# EAGLE design MainBoard (EAGLE 9.5.1)
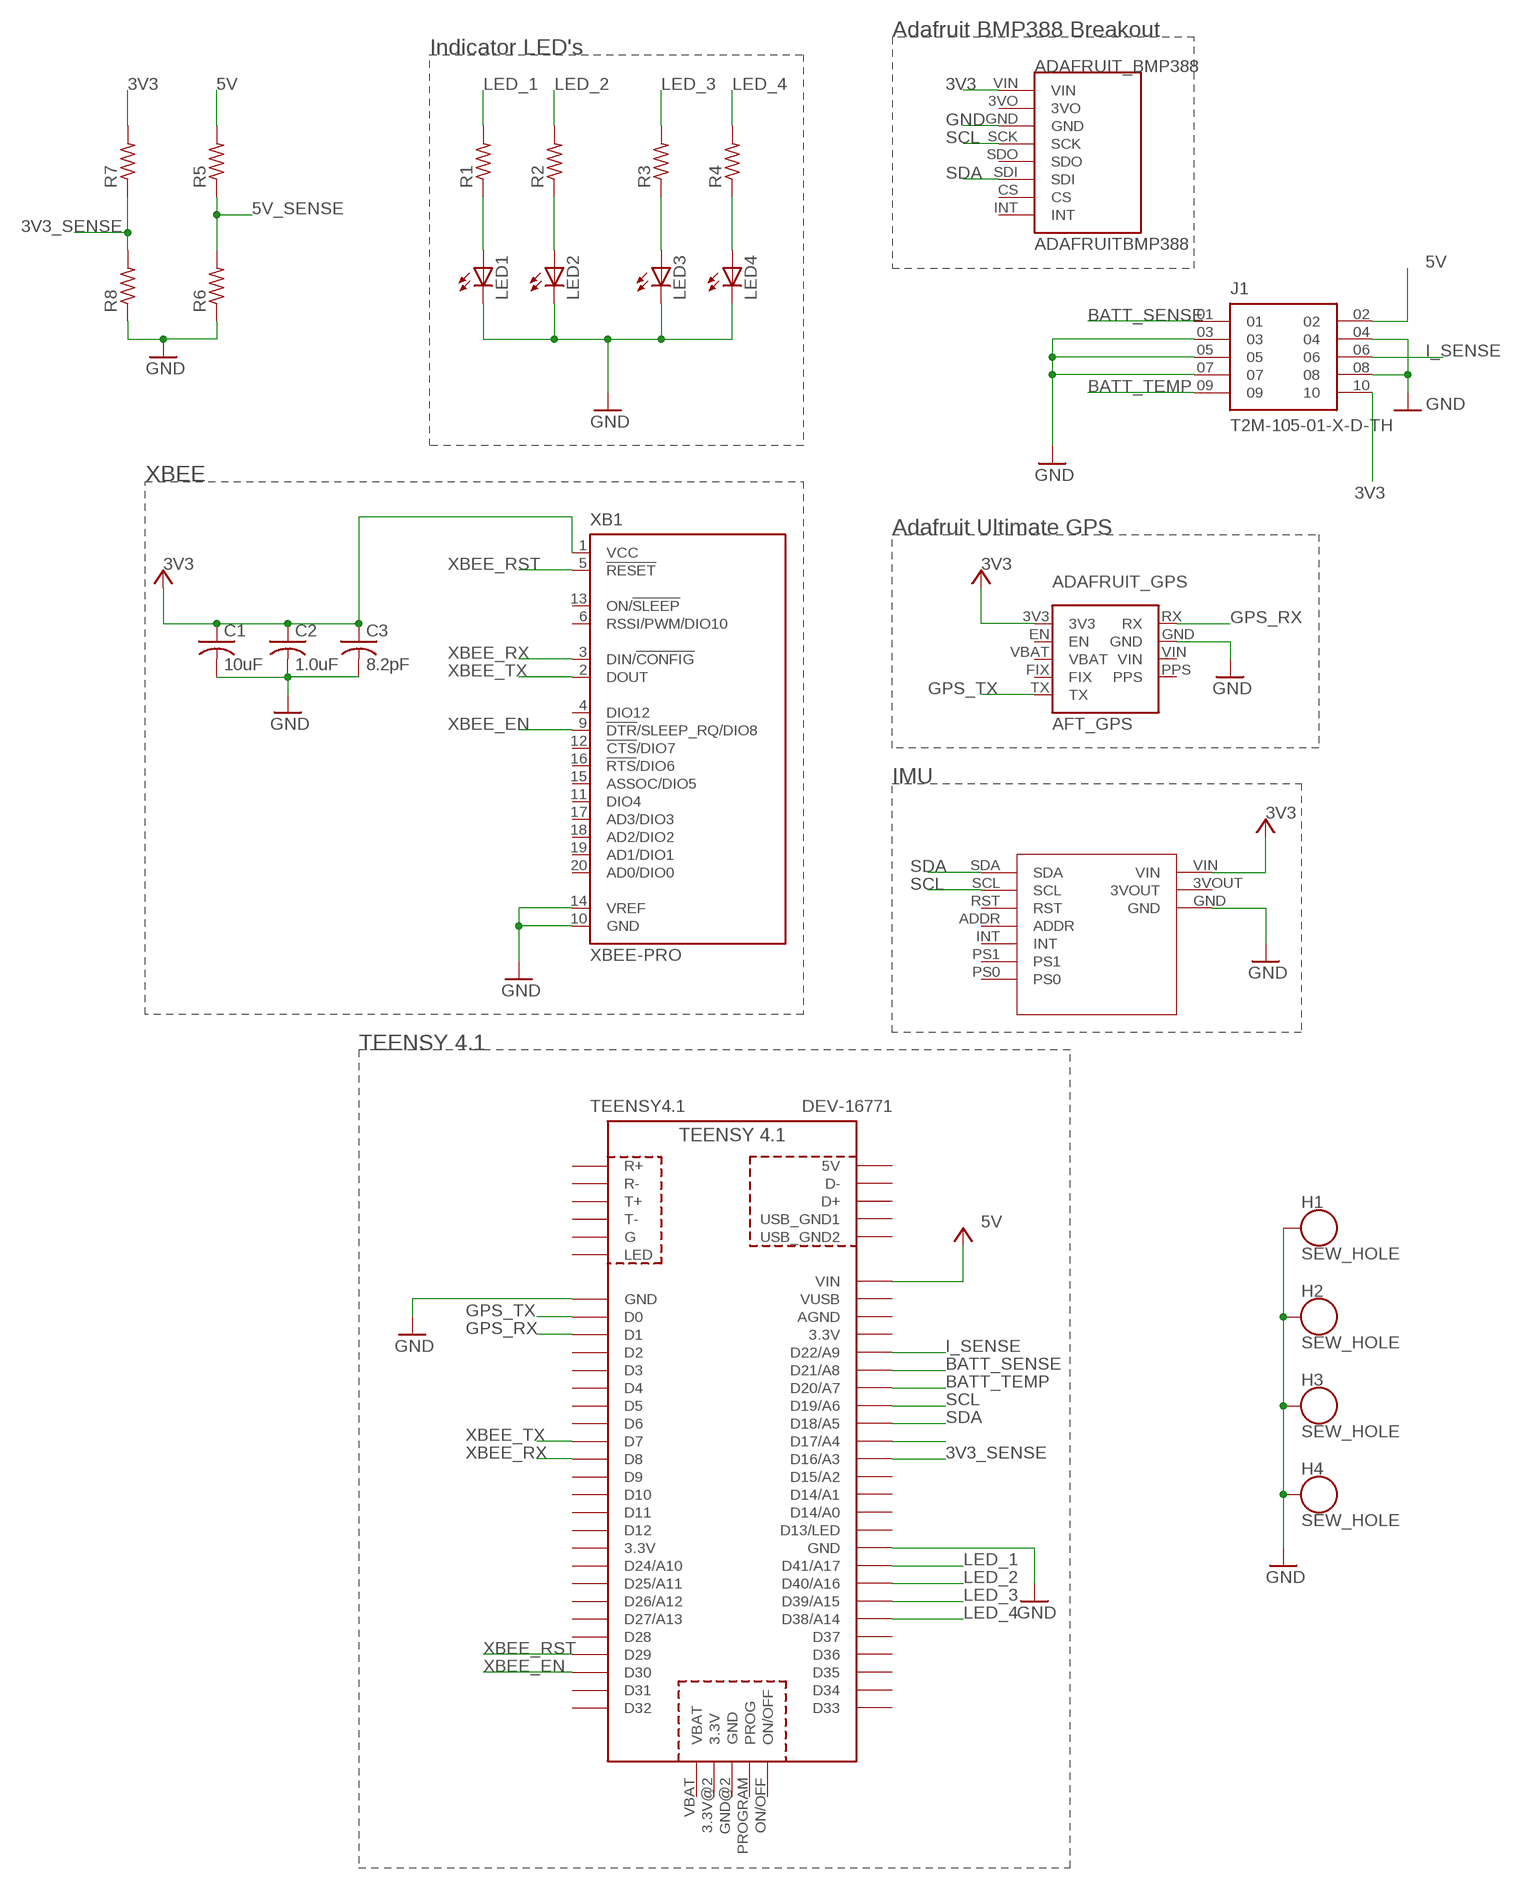
[diagram p0: schematic, sheet 1]

## Parts
ADAFRUIT_BMP388  ADAFRUITBMP388  [ADAFRUITBMP388]
ADAFRUIT_GPS  AFT_GPS  [AFT_GPS]
C1  10uF  C-USC0805  [C0805]
C2  1.0uF  C-USC0805  [C0805]
C3  8.2pF  C-USC0805  [C0805]
H1  SEW_HOLE  [SIMPLE_HOLE]
H2  SEW_HOLE  [SIMPLE_HOLE]
H3  SEW_HOLE  [SIMPLE_HOLE]
H4  SEW_HOLE  [SIMPLE_HOLE]
J1  T2M-105-01-X-D-TH  [SAMTEC_T2M-105-01-X-D-TH]
LED1  LED5MM  [LED5MM]
LED2  LED5MM  [LED5MM]
LED3  LED5MM  [LED5MM]
LED4  LED5MM  [LED5MM]
R1  R-US_R0805  [R0805]
R2  R-US_R0805  [R0805]
R3  R-US_R0805  [R0805]
R4  R-US_R0805  [R0805]
R5  R-US_R0805  [R0805]
R6  R-US_R0805  [R0805]
R7  R-US_R0805  [R0805]
R8  R-US_R0805  [R0805]
TEENSY4.1  DEV-16771  [DEV-16771]
U$1  IMU_BREAKOUT  [BNO055_BREAKOUT]
XB1  XBEE-PRO  [XBEE-PRO]

## Nets
3V3: ADAFRUIT_BMP388.VIN ADAFRUIT_GPS.3V3 C1.1 C2.1 C3.1 J1.10 R7.2 U$1.VIN XB1.1(VCC) ; supply symbol labelled VCC
3V3_SENSE: R7.1 R8.2 TEENSY4.1.D17/A3(D16/A3)
5V: J1.02 R5.2 TEENSY4.1.VIN ; supply symbol labelled VCC
5V_SENSE: R5.1 R6.2 TEENSY4.1.D18/A4(D17/A4)
BATT_SENSE: J1.01 TEENSY4.1.D22/A8(D21/A8)
BATT_TEMP: J1.09 TEENSY4.1.D21/A7(D20/A7)
GND: ADAFRUIT_BMP388.GND ADAFRUIT_GPS.GND C1.2 C2.2 C3.2 H1.P$1 H2.P$1 H3.P$1 H4.P$1 J1.03 J1.04 J1.05 J1.07 J1.08 LED1.K(C) LED2.K(C) LED3.K(C) LED4.K(C) R6.1 R8.1 TEENSY4.1.GND TEENSY4.1.GND@1(GND) U$1.GND XB1.10(GND) XB1.14(VREF)
GPS_RX: ADAFRUIT_GPS.RX TEENSY4.1.D1
GPS_TX: ADAFRUIT_GPS.TX TEENSY4.1.D0
I_SENSE: J1.06 TEENSY4.1.D23/A9(D22/A9)
LED_1: R1.2 TEENSY4.1.D41/A17
LED_2: R2.2 TEENSY4.1.D40/A16
LED_3: R3.2 TEENSY4.1.D39/A15
LED_4: R4.2 TEENSY4.1.D38/A14
N$8: LED1.A R1.1
N$9: LED2.A R2.1
N$10: LED3.A R3.1
N$11: LED4.A R4.1
SCL: ADAFRUIT_BMP388.SCK TEENSY4.1.D20/A6(D19/A6) U$1.SCL
SDA: ADAFRUIT_BMP388.SDI TEENSY4.1.D19/A5(D18/A5) U$1.SDA
XBEE_EN: TEENSY4.1.D30 XB1.9(!DTR!/SLEEP_RQ/DIO8)
XBEE_RST: TEENSY4.1.D29 XB1.5(!RESET)
XBEE_RX: TEENSY4.1.D8 XB1.3(DIN/!CONFIG)
XBEE_TX: TEENSY4.1.D7 XB1.2(DOUT)
Unconnected: ADAFRUIT_BMP388.3VO ADAFRUIT_BMP388.CS ADAFRUIT_BMP388.INT ADAFRUIT_BMP388.SDO ADAFRUIT_GPS.EN ADAFRUIT_GPS.FIX ADAFRUIT_GPS.PPS ADAFRUIT_GPS.VBAT ADAFRUIT_GPS.VIN TEENSY4.1.D2 TEENSY4.1.D3 TEENSY4.1.D4 TEENSY4.1.D5 TEENSY4.1.D6 TEENSY4.1.D9 TEENSY4.1.D10 TEENSY4.1.D11 TEENSY4.1.D12 TEENSY4.1.D13/LED TEENSY4.1.D14/A0 TEENSY4.1.D15/A1(D14/A1) TEENSY4.1.D16/A2(D15/A2) TEENSY4.1.D24/A10 TEENSY4.1.D25/A11 TEENSY4.1.D26/A12 TEENSY4.1.D27/A13 TEENSY4.1.D28 TEENSY4.1.D31 TEENSY4.1.D32 TEENSY4.1.D33 TEENSY4.1.D34 TEENSY4.1.D35 TEENSY4.1.D36 TEENSY4.1.D37 TEENSY4.1.D+ TEENSY4.1.D- TEENSY4.1.LED TEENSY4.1.ON/OFF TEENSY4.1.PROGRAM(PROG) TEENSY4.1.R+ TEENSY4.1.R- TEENSY4.1.T+ TEENSY4.1.T- U$1.3VOUT U$1.ADDR U$1.INT U$1.PS0 U$1.PS1 U$1.RST XB1.4(DIO12) XB1.6(RSSI/PWM/DIO10) XB1.11(DIO4) XB1.12(!CTS!/DIO7) XB1.13(ON/!SLEEP) XB1.15(ASSOC/DIO5) XB1.16(!RTS!/DIO6) XB1.17(AD3/DIO3) XB1.18(AD2/DIO2) XB1.19(AD1/DIO1) XB1.20(AD0/DIO0)

## Notes on the sheet
- Adafruit BMP388 Breakout
- Indicator LED's
- XBEE
- Adafruit Ultimate GPS
- IMU
- TEENSY 4.1

## Power pins joined to a net without a drawn wire
3.3V: TEENSY4.1.3.3V TEENSY4.1.3.3V@1(3.3V) TEENSY4.1.3.3V@2(3.3V)
5V: TEENSY4.1.5V
AGND: TEENSY4.1.AGND
G: TEENSY4.1.G
GND: TEENSY4.1.GND@2(GND)
USB_GND1: TEENSY4.1.USB_GND(USB_GND1)
USB_GND2: TEENSY4.1.USB_GND@2(USB_GND2)
VBAT: TEENSY4.1.VBAT
VUSB: TEENSY4.1.VUSB

## Library data of the parts
ADAFRUIT_BMP388 = adafruit BMP388:ADAFRUITBMP388
ADAFRUIT_GPS = adafruit_Ultimate_GPS_Breakout:AFT_GPS
C1-C3 = adafruit(seeIMUBreakout):C-US: CAPACITOR, American symbol
H1-H4 = SparkFun-Retired:SEW_HOLE: SparkFun LilyPad Sew Hole Simple sew-tap with .1" diameter hole with 20mil annular ring SparkFun Products: [PRODUCT 1] <[PRODUCT1LINK]> [PRODUCT 2] <PRODUCT2LINK> [PRODUCT 3] <PRODUCT3LINK>
J1 = T2M-105-01-X-D-TH:T2M-105-01-X-D-TH; MANUFACTURER: Samtec; MAXIMUM_PACKAGE_HEIGHT: 6.55mm; PARTREV: AH; STANDARD: Manufacturer Recommendations
LED1-LED4 = adafruit(seeIMUBreakout):LED: LED OSRAM: - CHIPLED LG R971, LG N971, LY N971, LG Q971, LY Q971, LO R971, LY R971 LH N974, LH R974 LS Q976, LO Q976, LY Q976 LO Q996 - Hyper CHIPLED LW Q18S LB Q993, LB Q99A, LB R99A - SideLED LS A670, LO A670, LY A670, LG A670, LP A670 LB A673, LV A673, LT A673, LW A673 LH A674 LY A675 LS A676, LA A676, LO A676, LY A676, LW A676 LS A679, LY A679, LG A679 - Hyper Micro SIDELED® LS Y876, LA Y876, LO Y876, LY Y876 LT Y87S - SmartLED LW L88C, LW L88S LB L89C, LB L89S, LG L890 LS L89K, LO L89K, LY L89K LS L896, LA L896, LO L896, LY L896 - TOPLED LS T670, LO T670, LY T670, LG T670, LP T670 LSG T670, LSP T670, LSY T670, LOP T670, LYG T670 LG T671, LOG T671, LSG T671 LB T673, LV T673, LT T673, LW T673 LH T674 LS T676, LA T676, LO T676, LY T676, LB T676, LH T676, LSB T676, LW T676 LB T67C, LV T67C, LT T67C, LS T67K, LO T67K, LY T67K, LW E67C LS E67B, LA E67B, LO E67B, LY E67B, LB E67C, LV E67C, LT E67C LW T67C LS T679, LY T679, LG T679 LS T770, LO T770, LY T770, LG T770, LP T770 LB T773, LV T773, LT T773, LW T773 LH T774 LS E675, LA E675, LY E675, LS T675 LS T776, LA T776, LO T776, LY T776, LB T776 LHGB T686 LT T68C, LB T68C - Hyper Mini TOPLED® LB M676 - Mini TOPLED Santana® LG M470 LS M47K, LO M47K, LY M47K Source: http://www.osram.convergy.de/
R1-R8 = adafruit(seeIMUBreakout):R-US_: RESISTOR, American symbol
TEENSY4.1 = DEV-16771(Teensy 4.1):DEV-16771: Teensy 4.1 i.MX ARM® Cortex®-M7 MPU Embedded Evaluation Board Check prices <https://pricing.snapeda.com/parts/DEV-16771/SparkFun%20Electronics/view-part?ref=eda>; AVAILABILITY: Warning; DESCRIPTION: RT1062 Teensy 4.1 i.MX ARM® Cortex®-M7 MPU Embedded Evaluation Board; MF: SparkFun Electronics; MP: DEV-16771; PACKAGE: None; PRICE: None; PURCHASE-URL: https://pricing.snapeda.com/search/part/DEV-16771/?ref=eda
U$1 = adafruit(seeIMUBreakout):IMU_BREAKOUT
XB1 = xbee:XBEE: XBee (TM) /XBee-PRO(TM) OEM RF Modules Source: MaxStream, Inc. xbee_productmanual.pdf; MPN: XBP24-AWI-001; OC_FARNELL: 1337916; OC_NEWARK: 42M2667

## Board
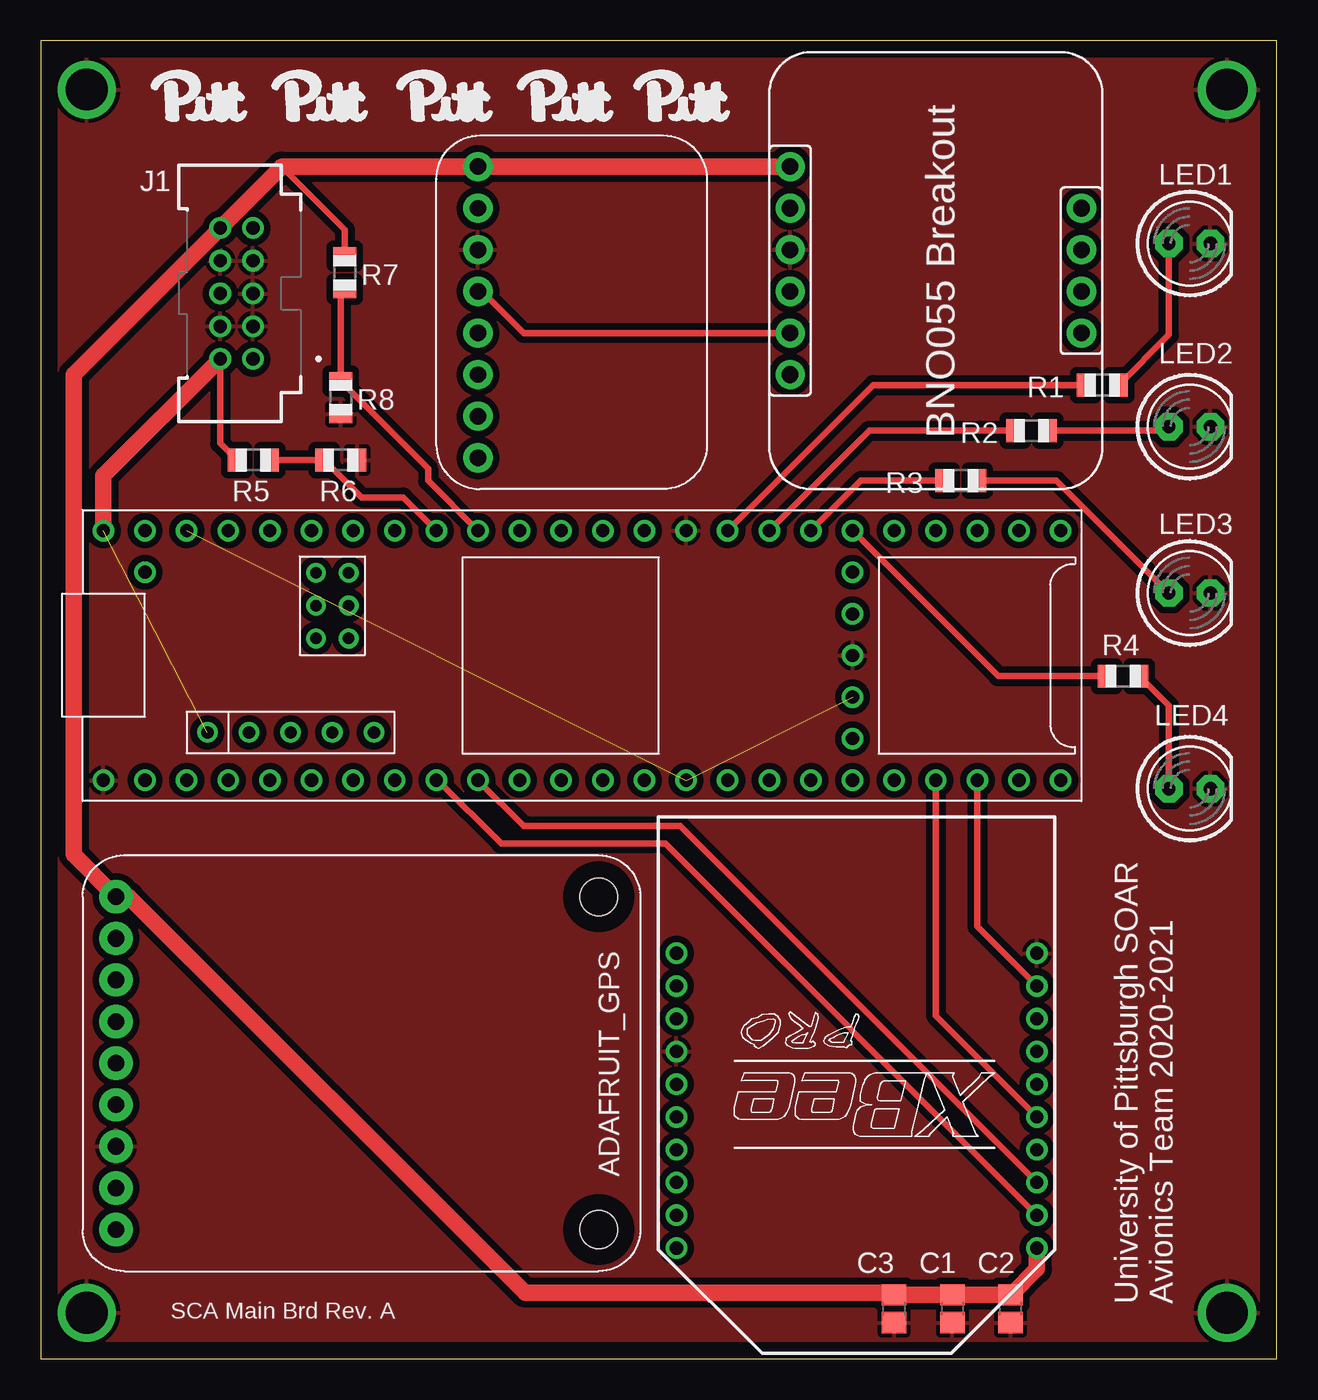
[diagram p1: board, top side]
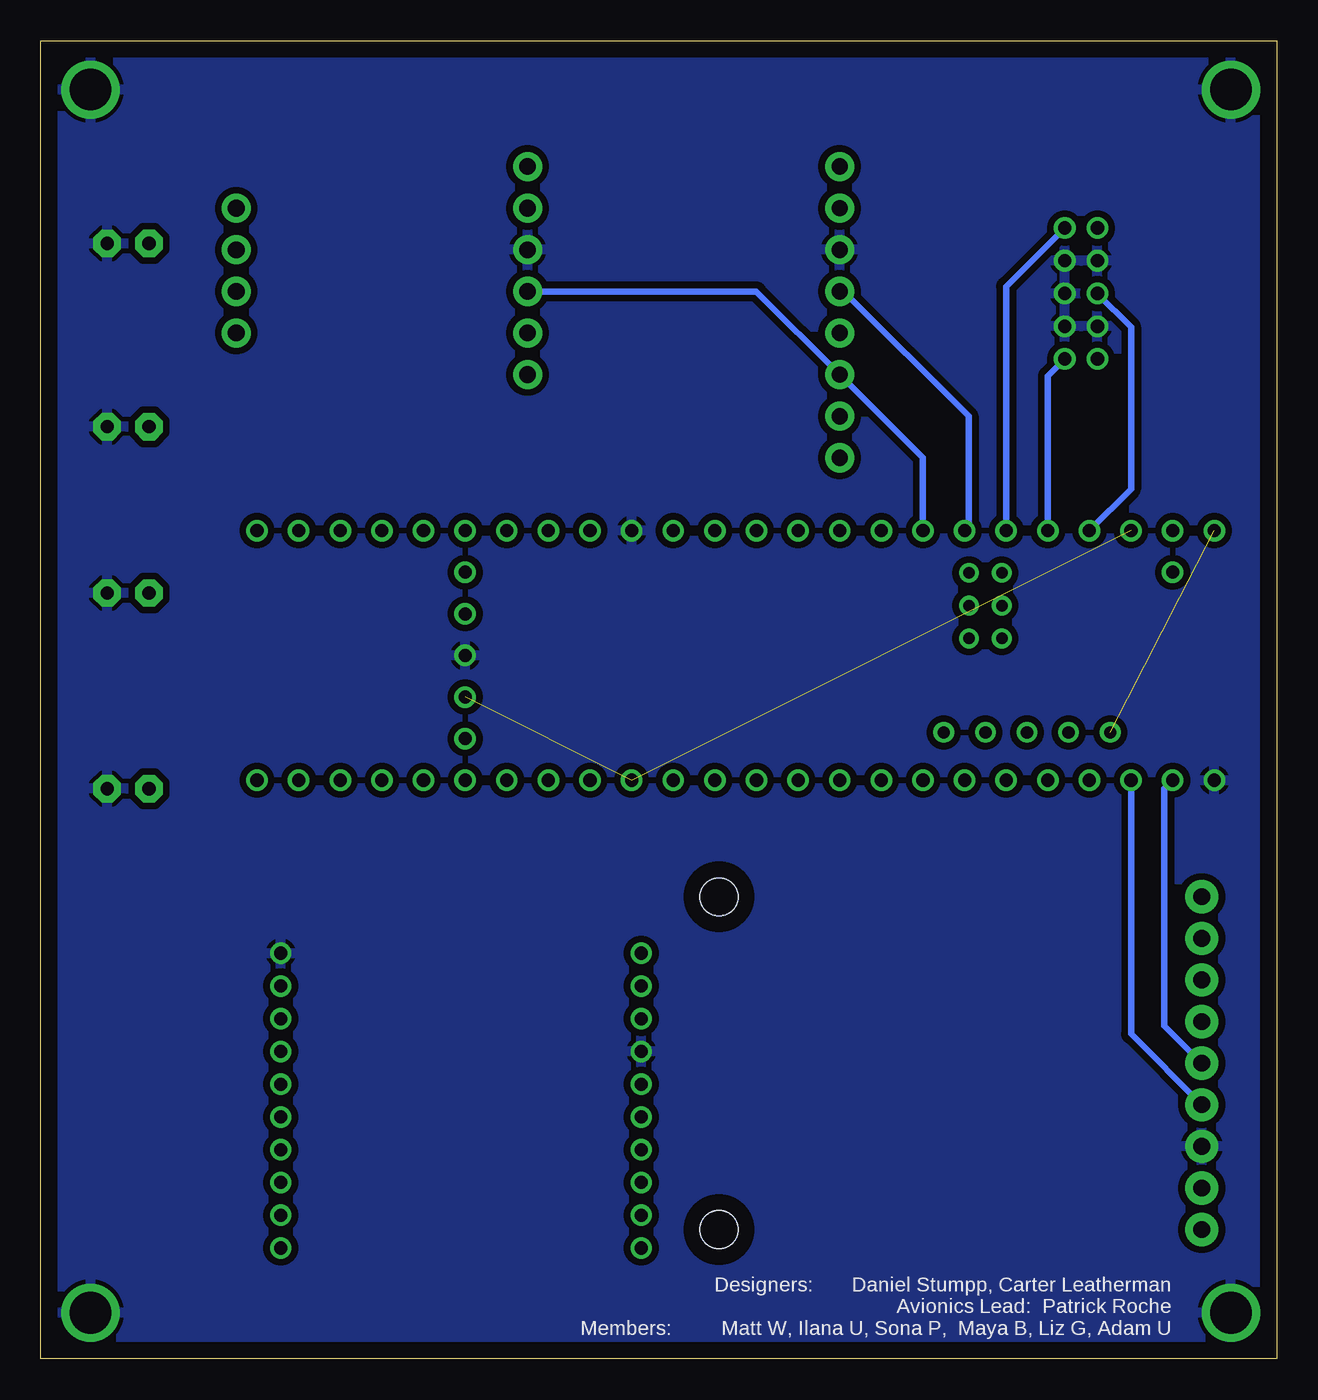
[diagram p2: board, bottom side, seen from below]

Size 75.42 x 80.44 mm. Coordinates in mm from the lower left corner, seen from the top.
Outline: 0,0 75.42,0 75.42,80.44 0,80.44 0,0
Copper layers (1*16): Top 0.035mm / dielectric 1.5mm / Bottom 0.035mm
Design rules "default": minimum track width 6mil, minimum drill 0.35mm, track to track 6mil, track to pad 6mil, pad to pad 6mil, via to via 6mil, smd to smd 6mil, copper to edge 40mil, drill to drill 6mil, minimum pad ring 10mil, minimum via ring 8mil, stop-mask expansion 4mil, vias tented up to drill 0mil, thermal gap 10mil

### Footprints (pad centres in the part's own frame; a part is rotated, then mirrored left to right if it is on the bottom)
ADAFRUITBMP388 = drill 1 pad 1.778: 3VO 4.445,2.54; CS 17.145,2.54; GND 6.985,2.54; INT 19.685,2.54; SCK 9.525,2.54; SDI 14.605,2.54; SDO 12.065,2.54; VIN 1.905,2.54
AFT_GPS = drill 1.016 pad 2.032: 3V3 2.54,2.032; EN 5.08,2.032; FIX 10.16,2.032; GND 17.78,2.032; PPS 22.86,2.032; RX 15.24,2.032; TX 12.7,2.032; VBAT 7.62,2.032; VIN 20.32,2.032 | hole 2.286: 2.54,31.496; 22.86,31.496
C0805 = smd 1.3 x 1.5: 1 -0.85,0; 2 0.85,0
SIMPLE_HOLE = drill 2.54 pad 3.048: P$1 0,0
SAMTEC_T2M-105-01-X-D-TH = drill 0.813 pad 1.163: 01 -4,-1; 02 -4,1; 03 -2,-1; 04 -2,1; 05 0,-1; 06 0,1; 07 2,-1; 08 2,1; 09 4,-1; 10 4,1
LED5MM = drill 0.813 pad 1.676 octagon: A -1.27,0; K 1.27,0
R0805 = smd 1.1 x 1.4: 1 -1,0; 2 1,0
DEV-16771 = drill 0.8: 3.3V 6.35,-7.62; 3.3V@1 -24.13,7.62; 3.3V@2 16.51,-2.54; AGND -26.67,7.62; D0 -26.67,-7.62; D1 -24.13,-7.62; D2 -21.59,-7.62; D3 -19.05,-7.62; D4 -16.51,-7.62; D5 -13.97,-7.62; D6 -11.43,-7.62; D7 -8.89,-7.62; D8 -6.35,-7.62; D9 -3.81,-7.62; D10 -1.27,-7.62; D11 1.27,-7.62; D12 3.81,-7.62; D13/LED 3.81,7.62; D14/A0 1.27,7.62; D15/A1 -1.27,7.62; D16/A2 -3.81,7.62; D17/A3 -6.35,7.62; D18/A4 -8.89,7.62; D19/A5 -11.43,7.62; D20/A6 -13.97,7.62; D21/A7 -16.51,7.62; D22/A8 -19.05,7.62; D23/A9 -21.59,7.62; D24/A10 8.89,-7.62; D25/A11 11.43,-7.62; D26/A12 13.97,-7.62; D27/A13 16.51,-7.62; D28 19.05,-7.62; D29 21.59,-7.62; D30 24.13,-7.62; D31 26.67,-7.62; D32 29.21,-7.62; D33 29.21,7.62; D34 26.67,7.62; D35 24.13,7.62; D36 21.59,7.62; D37 19.05,7.62; D38/A14 16.51,7.62; D39/A15 13.97,7.62; D40/A16 11.43,7.62; D41/A17 8.89,7.62; GND -29.21,-7.62; GND@1 6.35,7.62; GND@2 16.51,0; ON/OFF 16.51,5.08; PROGRAM 16.51,2.54; VBAT 16.51,-5.08; VIN -29.21,7.62; VUSB -26.67,5.08 | drill 0.75: 5V -22.86,-4.7; D+ -17.78,-4.7; D- -20.32,-4.7; USB_GND -15.24,-4.7; USB_GND@2 -12.7,-4.7 | drill 0.7: G -14.24,3.04; LED -16.24,3.04; R+ -16.24,5.04; R- -14.24,5.04; T+ -14.24,1.04; T- -16.24,1.04
BNO055_BREAKOUT = drill 1.016 pad 1.778: 3VOUT 9.525,1.27; ADDR 17.145,19.05; GND 12.065,1.27; INT 14.605,19.05; PS0 9.525,19.05; PS1 12.065,19.05; RST 19.685,1.27; SCL 17.145,1.27; SDA 14.605,1.27; VIN 6.985,1.27
XBEE-PRO = drill 0.8 pad 1.27: 1 -11,9; 2 -11,7; 3 -11,5; 4 -11,3; 5 -11,1; 6 -11,-1; 7 -11,-3; 8 -11,-5; 9 -11,-7; 10 -11,-9; 11 11,-9; 12 11,-7; 13 11,-5; 14 11,-3; 15 11,-1; 16 11,1; 17 11,3; 18 11,5; 19 11,7; 20 11,9

### Placement (x,y rotation side)
ADAFRUIT_BMP388  24.13,74.68 270 top
ADAFRUIT_GPS  2.54,30.73 270 top
C1  55.63,3.05 270 top
C2  59.18,3.05 270 top
C3  52.07,3.05 270 top
H1  72.39,2.79 0 top
H2  2.79,2.79 0 top
H3  72.39,77.47 0 top
H4  2.79,77.47 0 top
J1  11.94,65.02 90 top
LED1  70.1,68.07 0 top
LED2  70.1,56.9 0 top
LED3  70.1,46.74 0 top
LED4  70.1,34.8 0 top
R1  64.77,59.44 180 top
R2  60.45,56.64 180 top
R3  56.13,53.59 180 top
R4  66.04,41.66 180 top
R5  12.95,54.86 180 top
R6  18.29,54.86 180 top
R7  18.54,66.29 90 top
R8  18.29,58.67 90 top
TEENSY4.1  33.02,42.93 0 top
U$1  44.45,79.76 270 top
XB1  49.78,15.75 180 top

### Tracks (layer width: path | path; a pad name or v marks a point on that pad's centre or on a via)
3.3V  (2 unrouted)
3V3
  Top 0.406: 14.69,72.77 18.54,68.91 R7.2
  Top 1.016: U$1.VIN ADAFRUIT_BMP388.VIN 14.69,72.77 J1.10 1.99,60.07 1.99,30.78 ADAFRUIT_GPS.3V3 5.37,28.19 29.55,4.02 51.95,4.02 C3.1 C1.1 C2.1 59.2,3.9 60.78,5.48 XB1.1
3V3_SENSE
  Top 0.406: R7.1 18.29,65.04 R8.2 23.62,54.34 23.62,53.59 TEENSY4.1.D17/A3
5V  (1 unrouted)
  Top 0.406: J1.02 10.94,55.88 R5.2
  Top 0.711: 3.81,50.63 TEENSY4.1.VIN
  Top 1.016: J1.02 3.81,53.9 3.81,50.63
5V_SENSE
  Top 0.406: R5.1 R6.2 19.57,52.58 22.1,52.58 TEENSY4.1.D18/A4
BATT_SENSE
  Bottom 0.406: J1.01 13.97,59.99 TEENSY4.1.D22/A8
BATT_TEMP
  Bottom 0.406: J1.09 16.51,65.45 TEENSY4.1.D21/A7
GND
  pour Bottom (isolate 0.406): -1.02,82.3 -1.02,-2.54 78.74,-2.54 78.74,82.3
  pour Top (isolate 0.406): -0.51,82.04 77.98,82.04 77.98,-2.29 -0.51,-2.29
GPS_RX
  Bottom 0.406: TEENSY4.1.D1 8.89,19.81 ADAFRUIT_GPS.RX
GPS_TX
  Bottom 0.406: TEENSY4.1.D0 6.86,34.8 6.86,20.32 ADAFRUIT_GPS.TX
I_SENSE
  Bottom 0.406: J1.06 8.89,62.98 8.89,53.09 TEENSY4.1.D23/A9
LED_1
  Top 0.406: TEENSY4.1.D41/A17 50.8,59.44 R1.2
LED_2
  Top 0.406: TEENSY4.1.D40/A16 50.55,56.64 R2.2
LED_3
  Top 0.406: TEENSY4.1.D39/A15 50.04,53.59 R3.2
LED_4
  Top 0.406: TEENSY4.1.D38/A14 58.42,41.66 R4.2
N$8
  Top 0.406: R1.1 68.83,62.5 LED1.A
N$9
  Top 0.406: R2.1 68.58,56.64 LED2.A
N$10
  Top 0.406: R3.1 61.98,53.59 LED3.A
N$11
  Top 0.406: R4.1 68.83,39.86 LED4.A
SCL
  Top 0.406: ADAFRUIT_BMP388.SCK 26.92,65.15 29.46,62.61 U$1.SCL
  Bottom 0.406: TEENSY4.1.D20/A6 18.8,50.8 18.8,57.53 26.42,65.15 ADAFRUIT_BMP388.SCK
SDA
  Bottom 0.406: TEENSY4.1.D19/A5 21.59,54.99 ADAFRUIT_BMP388.SDI 31.75,65.15 U$1.SDA
XBEE_EN
  Top 0.406: TEENSY4.1.D30 57.15,26.38 XB1.9
XBEE_RST
  Top 0.406: TEENSY4.1.D29 54.61,20.92 XB1.5
XBEE_RX
  Top 0.406: XB1.3 39.02,32.51 29.46,32.51 TEENSY4.1.D8
XBEE_TX
  Top 0.406: XB1.2 38.09,31.45 28.09,31.45 24.23,35.31 TEENSY4.1.D7

### Text on the board
tPlace: SCA Main Brd Rev. A | University of Pittsburgh SOAR / Avionics Team 2020-2021
bNames: Designers: Daniel Stumpp, Carter Leatherman / Avionics Lead: Patrick Roche / Members: Matt W, Ilana U, Sona P, Maya B, Liz G, Adam U